# EAGLE design riffle-0.96-tab (EAGLE 7.3.0)
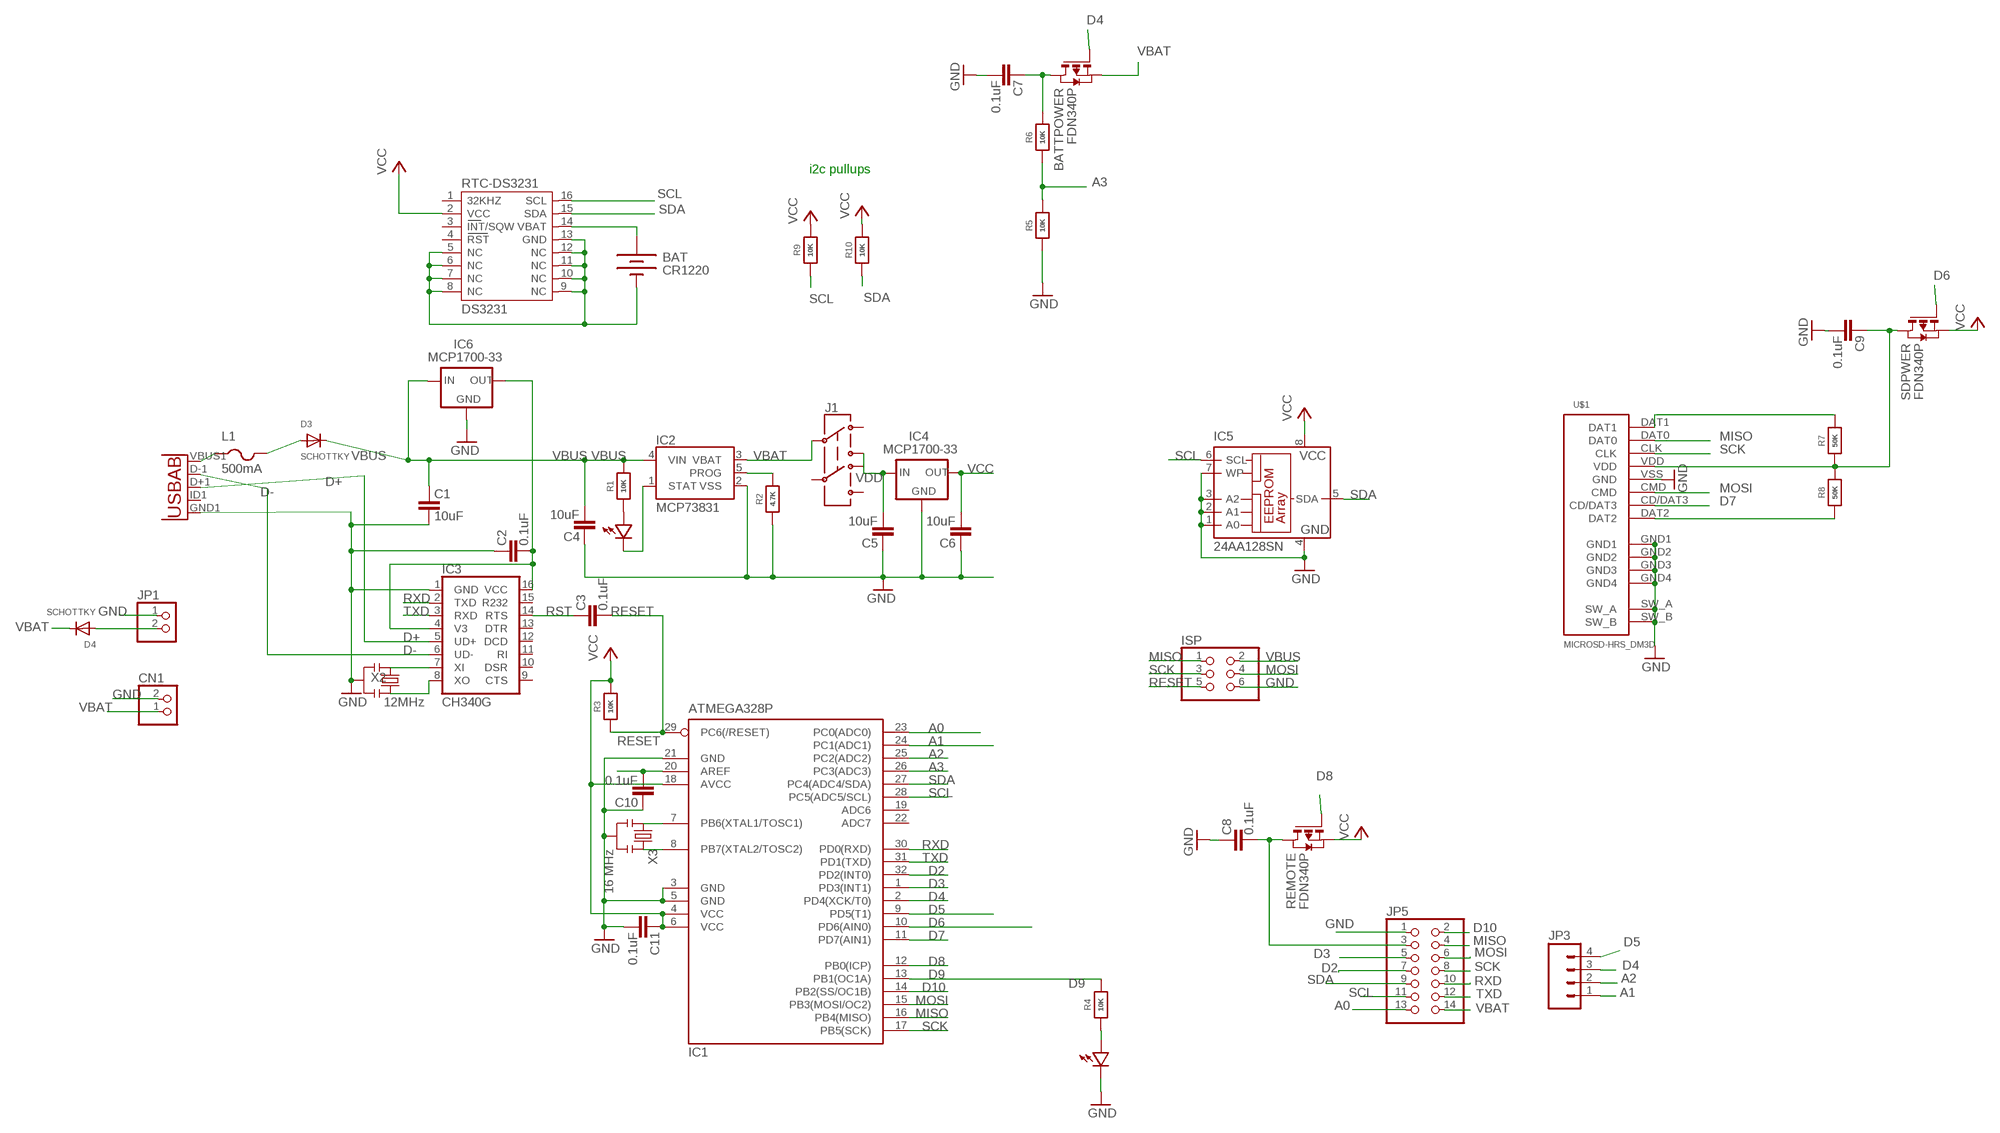
[diagram p0: schematic, sheet 1]

## Parts
BAT  CR1220  BATTERYBATTERY_12MM_SMT  [BATTCON_12MM_SMT]
BATTPOWER  FDN340P  PMOSSOT23  [SOT-23]
C1  10uF  CAP0603-CAP  [0603-CAP]
C2  0.1uF  CAP0603-CAP  [0603-CAP]
C3  0.1uF  CAP0603-CAP  [0603-CAP]
C4  10uF  CAP0603-CAP  [0603-CAP]
C5  10uF  CAP0603-CAP  [0603-CAP]
C6  10uF  CAP0603-CAP  [0603-CAP]
C7  0.1uF  CAP0603-CAP  [0603-CAP]
C8  0.1uF  CAP0603-CAP  [0603-CAP]
C9  0.1uF  CAP0603-CAP  [0603-CAP]
C10  0.1uF  CAP0603-CAP  [0603-CAP]
C11  0.1uF  CAP0603-CAP  [0603-CAP]
CN1  JST_2PIN-SMT-RA  [JST-PH-2-SMT-RA]
D1  LED0603  [0603-LED]
D2  LED0603  [0603-LED]
D3  SCHOTTKY  DIODE_SOD-123FL  [SOD-123FL]
D4  SCHOTTKY  DIODE_SOD-123FL  [SOD-123FL]
IC1  ATMEGA328P  MEGA8-AI  [TQFP32-08]
IC2  MCP73831  [SOT23-5]
IC3  CH340G  [SO16]
IC4  MCP1700-33  MCP1700SOT89  [SOT89]
IC5  24AA128SN  [SO-08]
IC6  MCP1700-33  MCP1700SOT89  [SOT89]
ISP  PINHD-2X3  [2X03]
J1  AYZ0202  [AYZ0202]
JP1  PINHD-1X2  [1X02]
JP3  M04SMD  [1X04-SMD]
JP5  PINHD-2X7  [2X07]
L1  500mA  PTCFUSE-1206  [R1206]
R1  10K  RESISTOR_0603_NOOUT  [0603-NO]
R2  4.7K  RESISTOR_0603_NOOUT  [0603-NO]
R3  10K  RESISTOR_0603_NOOUT  [0603-NO]
R4  10K  RESISTOR_0603_NOOUT  [0603-NO]
R5  10K  RESISTOR_0603_NOOUT  [0603-NO]
R6  10K  RESISTOR_0603_NOOUT  [0603-NO]
R7  50K  RESISTOR_0603_NOOUT  [0603-NO]
R8  50K  RESISTOR_0603_NOOUT  [0603-NO]
R9  10K  RESISTOR_0603_NOOUT  [0603-NO]
R10  10K  RESISTOR_0603_NOOUT  [0603-NO]
REMOTE  FDN340P  PMOSSOT23  [SOT-23]
RTC-DS3231  DS3231  [DS3231]
SDPWER  FDN340P  PMOSSOT23  [SOT-23]
U$1  MICROSD-HRS_DM3D  [DM3D]
U$4  USB-AB""  [USB-AB-MICRO-SMD_V02_BOSS]
X2  12MHz  RESONATORSMD  [RESONATOR-SMD]
X3  16 MHz  RESONATORSMD  [RESONATOR-SMD]

## Nets
A0: IC1.23(PC0(ADC0)) JP5.13
A1: IC1.24(PC1(ADC1)) JP3.1
A2: IC1.25(PC2(ADC2)) JP3.2
A3: IC1.26(PC3(ADC3)) R5.2 R6.1
AREF: C10.1 IC1.20(AREF)
D2: IC1.32(PD2(INT0)) JP5.7
D3: IC1.1(PD3(INT1)) JP5.5
D4: BATTPOWER.3(G) IC1.2(PD4(XCK/T0)) JP3.3
D5: IC1.9(PD5(T1)) JP3.4
D6: IC1.10(PD6(AIN0)) SDPWER.3(G)
D7: IC1.11(PD7(AIN1)) U$1.CD/DAT3
D8: IC1.12(PB0(ICP)) REMOTE.3(G)
D9: IC1.13(PB1(OC1A)) R4.2
D10: IC1.14(PB2(SS/OC1B)) JP5.2
D+: IC3.5(UD+) U$4.D+1(D+)
D-: IC3.6(UD-) U$4.D-1(D-)
GND: BAT.P$1(-) C1.1 C2.2 C4.2 C5.2 C6.2 C7.1 C8.2 C9.1 C10.2 C11.1 CN1.2 D2.MINUS IC1.3(GND) IC1.5(GND) IC1.21(GND) IC2.2(VSS) IC3.1(GND) IC4.1(GND) IC5.1(A0) IC5.2(A1) IC5.3(A2) IC5.4(GND) IC5.7(WP) IC6.1(GND) ISP.6 JP1.1 JP5.1 R2.1 R5.1 RTC-DS3231.5(NC) RTC-DS3231.6(NC) RTC-DS3231.7(NC) RTC-DS3231.8(NC) RTC-DS3231.9(NC) RTC-DS3231.10(NC) RTC-DS3231.11(NC) RTC-DS3231.12(NC) RTC-DS3231.13(GND) U$1.GND1 U$1.GND2 U$1.GND3 U$1.GND4 U$1.SW_A U$1.SW_B U$1.VSS(GND) U$4.GND1(GND) X2.2 X3.2
MISO: IC1.16(PB4(MISO)) ISP.1 JP5.4 U$1.DAT0
MOSI: IC1.15(PB3(MOSI/OC2)) ISP.4 JP5.6 U$1.CMD
N$1: D1.PLUS R1.1
N$2: IC1.7(PB6(XTAL1/TOSC1)) X3.1
N$3: IC1.8(PB7(XTAL2/TOSC2)) X3.3
N$4: C9.2 R7.1 R8.2 SDPWER.1(D) U$1.VDD
N$5: D1.MINUS IC2.1(STAT)
N$6: IC2.5(PROG) R2.2
N$7: C8.1 JP5.3 REMOTE.1(D)
N$8: C2.1 IC3.4(V3) IC3.16(VCC) IC6.3(OUT)
N$10: D3.A L1.2
N$11: IC3.7(XI) X2.1
N$13: IC3.8(XO) X2.3
N$14: D4.A JP1.2
N$15: BATTPOWER.1(D) C7.2 R6.2
N$16: R7.2 U$1.DAT1
N$17: D2.PLUS R4.1
N$18: R8.1 U$1.DAT2
N$19: L1.1 U$4.VBUS1(VBUS)
RESET: C3.1 IC1.29(PC6(/RESET)) ISP.5 R3.1
RST: C3.2 IC3.14(RTS)
RTC_BATT: BAT.P$2(+) RTC-DS3231.14(VBAT)
RXD: IC1.30(PD0(RXD)) IC3.2(TXD) JP5.10
SCK: IC1.17(PB5(SCK)) ISP.3 JP5.8 U$1.CLK
SCL: IC1.28(PC5(ADC5/SCL)) IC5.6(SCL) JP5.11 R9.1 RTC-DS3231.16(SCL)
SDA: IC1.27(PC4(ADC4/SDA)) IC5.5(SDA) JP5.9 R10.1 RTC-DS3231.15(SDA)
TXD: IC1.31(PD1(TXD)) IC3.3(RXD) JP5.12
VBAT [vcc]: BATTPOWER.2(S) CN1.1 D4.C IC2.3(VBAT) J1.2 JP5.14
VBUS [vcc]: C1.2 C4.1 D3.C IC2.4(VIN) IC6.2(IN) ISP.2 R1.2
VCC: C6.1 C11.2 IC1.4(VCC) IC1.6(VCC) IC1.18(AVCC) IC4.3(OUT) IC5.8(VCC) R3.2 R9.2 R10.2 REMOTE.2(S) RTC-DS3231.2(VCC) SDPWER.2(S)
VDD: C5.1 IC4.2(IN) J1.1
Unconnected: IC1.19(ADC6) IC1.22(ADC7) IC3.9(CTS) IC3.10(DSR) IC3.11(RI) IC3.12(DCD) IC3.13(DTR) IC3.15(R232) J1.3 J1.4 J1.5 J1.6 RTC-DS3231.1(32KHZ) RTC-DS3231.3(INT/SQW) RTC-DS3231.4(RST) U$4.ID1(USBID)

## Notes on the sheet
- i2c pullups

## Library data of the parts
BAT = SparkFunNew:BATTERY: Battery Holders Various common sizes : AA, AAA, 20mm coin cell and 12mm coin cell.
BATTPOWER REMOTE SDPWER = zetex:PMOSSOT23: MOS FET; OC_FARNELL: unknown; OC_NEWARK: unknown
C1-C11 = SparkFun:CAP: Capacitor Standard 0603 ceramic capacitor, and 0.1" leaded capacitor.
CN1 = adafruit:JST_2PIN: JST 2-Pin Connectors of various flavors SMT-RA (S2B-PH-SM4) 4UConnector #17311 SMT (B2B-PH-SM4) THM-RA (S2B-PH) THM (B2B-PH)
D1 D2 = LowPowerLab:LED
D3 D4 = adafruit:DIODE: Diode SMADIODE - SMA Surface Mount Package 20V 1A Schottky Diode Digikey: 641-1014-6-ND DO-1N4148 - Through Hole Small Current Diode SOD-123 20V 1 A (.5mV Vf) Schottky Diode - Digikey: MBRX120TPMSCT-ND SOD-323 10V 570mA (.38mV Vf, 3ns) Schottky Diode - Digikey: ZLLS410CT-ND SOD-523 30V 30mA Schottky Diode (RB751S-40TE61) - Digikey: RB751S-40TE61CT-ND SOT23-R/W - SOT23 Package (R = Solder Paste/Reflow Ovens, W = Hand-Soldering) BAT54Film 40V 300mA - Digikey: 497-7162-1-ND
IC1 = atmel:MEGA8: MICROCONTROLLER 8 Kbytes FLASH, 1 kbytes SRAM, 512 bytes EEPROM, USART, 6-channel 10 bit ADC, 2-channel 8 bit ADC Pin compatible with Atmega48, ATMega88, ATMega168 Source: avr.lbr; MPN: ATMEGA8-16AU; OC_FARNELL: 9171371; OC_NEWARK: 73M8863
IC2 = SparkFunNew:MCP73831: Microchip's MCP73831 Miniature single cell, fully integrated Li-Ion, Li-polymer charge management controller http://ww1.microchip.com/downloads/en/DeviceDoc/21984a.pdf
IC3 = SparkFunNew:CH340
IC4 IC6 = adafruit:MCP1700: VOLTAGE REGULATOR
IC5 = microchip:24*: Serial EEPROM I2C; MF: MICROCHIP; MPN: 24AA128-I/SN; OC_FARNELL: unknown; OC_NEWARK: 92C6842
ISP = pinhead:PINHD-2X3: PIN HEADER
J1 = SparkFunNew:AYZ0202: SPDT Slide Switch Simple SMD single-pull double-throw slide switch. Good for less than 350mA power switch, switching UARTs between devices, etc. Spark Fun Electronics SKU : COM-00597
JP1 = pinhead:PINHD-1X2: PIN HEADER
JP3 = SparkFun:M04: Header 4 Standard 4-pin 0.1" header. Use with straight break away headers (SKU : PRT-00116), right angle break away headers (PRT-00553), swiss pins (PRT-00743), machine pins (PRT-00117), and female headers (PRT-00115). Molex polarized connector foot print use with SKU : PRT-08231 with associated crimp pins and housings.
JP5 = pinhead:PINHD-2X7: PIN HEADER
L1 = adafruit:PTCFUSE: PTC fuses, resettable thermistors
R1-R10 = microbuilder:RESISTOR: Resistors For new designs, use the packages preceded by an '_' character since they are more reliable: The following footprints should be used on most boards: _0402 - Standard footprint for regular board layouts _0603 - Standard footprint for regular board layouts _0805 - Standard footprint for regular board layouts _1206 - Standard footprint for regular board layouts For extremely tight-pitch boards where space is at a premium, the following 'micro-pitch' footprints can be used (smaller pads, no silkscreen outline, etc.): _0402MP - Micro-pitch footprint for very dense/compact boards _0603MP - Micro-pitch footprint for very dense/compact boards _0805MP - Micro-pitch footprint for very dense/compact boards _1206MP - Micro-pitch footprint for very dense/compact boards
RTC-DS3231 = _lh-library:DS3231
U$1 = hrs_DM3D-SF:MICROSD-HRS_DM3D
U$4 = Testing:USB-AB: This is a USB AB connector that is compatible with USB OTG. i.e. this connector can serve as a host or device
X2 = SparkFunNew:RESONATOR: Resonator Small SMD resonator. This is the itty bitty 10/20MHz resonators with built in caps. CSTCE10M0G55 and CSTCE20M0V53. Footprint has been reviewed closely but hasn't been tested yet.
X3 = SparkFun:RESONATOR: Resonator Small SMD resonator. This is the itty bitty 10/20MHz resonators with built in caps. CSTCE10M0G55 and CSTCE20M0V53. Footprint has been reviewed closely but hasn't been tested yet.

## Board
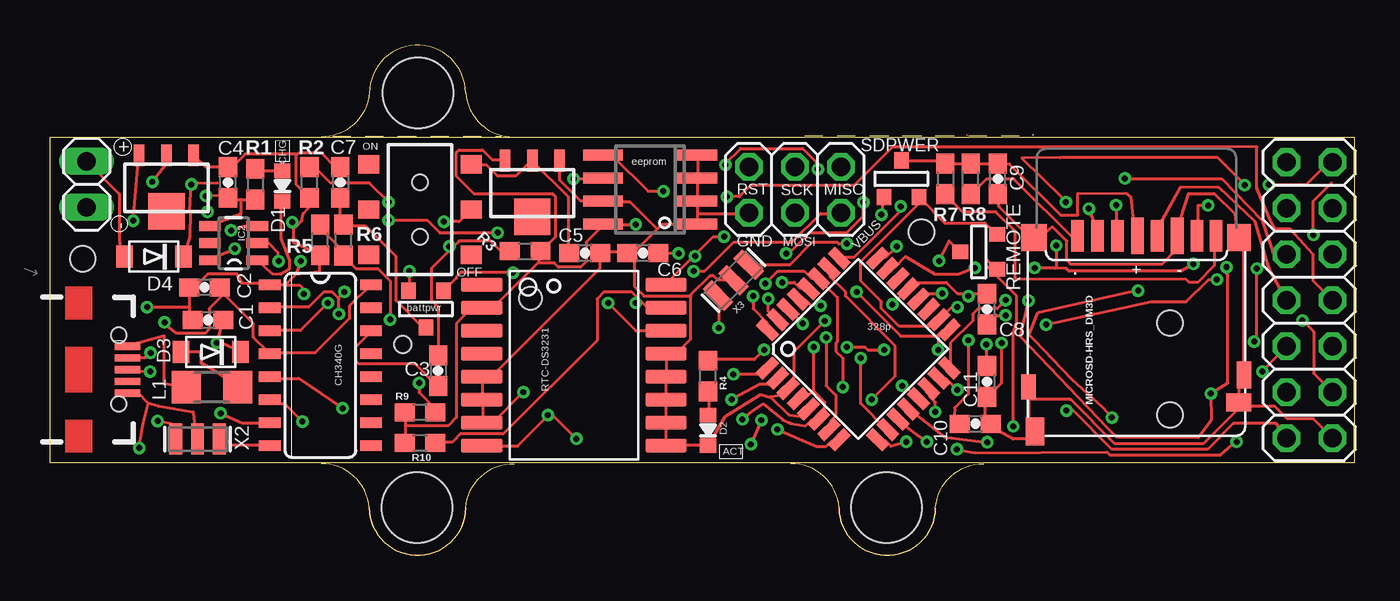
[diagram p1: board, top side]
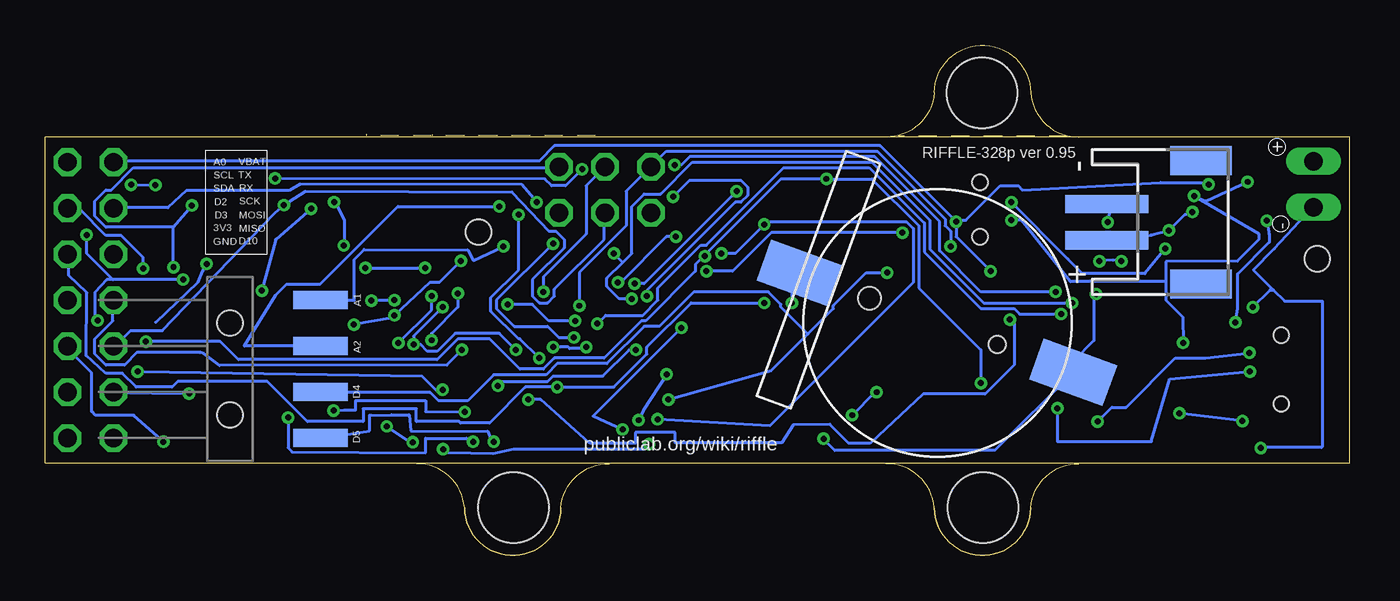
[diagram p2: board, bottom side, seen from below]

Size 72 x 28.19 mm. Coordinates in mm from the lower left corner, seen from the top.
Outline: 14.94,23.12 arc86 17.6,25.56 arc-179 22.92,25.56 arc86 25.59,23.12
Outline: 48.86,2.63 arc-179 43.54,2.63
Outline: 48.86,2.63 arc-86 51.52,5.07
Outline: 43.54,2.63 arc179 48.86,2.63
Outline: 43.54,2.63 arc86 40.87,5.07
Outline: 22.92,2.63 arc-179 17.6,2.63
Outline: 22.92,2.63 arc-86 25.59,5.07
Outline: 17.6,2.63 arc179 22.92,2.63
Outline: 17.6,2.63 arc86 14.94,5.07
Outline: 15.58,23.16 24.89,23.16 24.89,23.22
Outline: 41.63,23.18 50.61,23.18 50.61,23.26
Outline: 45.29,23.19 54.27,23.19 54.27,23.27
Outline: 0,5.11 0,23.11 72,23.11 72,5.11 0,5.11
Copper layers (1*16): Top 0.0356mm / dielectric 1.5011mm / Bottom 0.0356mm
Design rules "LaenPCBOrder": minimum track width 6mil, minimum drill 13mil, track to track 6mil, track to pad 6mil, pad to pad 6mil, via to via 6mil, smd to smd 6mil, copper to edge 15mil, drill to drill 6mil, minimum pad ring 7mil, minimum via ring 7mil, stop-mask expansion 3mil, vias tented up to drill 0mil, thermal gap 10mil
Holes 1.4 mm at 48.08,17.87 1.78,16.39
Holes 3.9 mm at 20.3,25.55 46.16,2.64 20.23,2.64

### Footprints (pad centres in the part's own frame; a part is rotated, then mirrored left to right if it is on the bottom)
BATTCON_12MM_SMT = smd 2.4 x 4.3: P$1 0,11.96 | smd 2.4 x 4.2: P$2 0,-4.1 | hole 0.95: 0,7.5 | hole 1.25: 0,0
SOT-23 = smd 0.787 x 0.889: 1 0.025,-1.016; 2 -0.94,1.016; 3 0.991,1.016
0603-CAP = smd 1.1 x 1: 1 -0.85,0; 2 0.85,0
JST-PH-2-SMT-RA = smd 1 x 4.6: 1 1,-3.7; 2 -1,-3.7 | smd 1.6 x 3.4: NC1 -3.4,1.5; NC2 3.4,1.5
0603-LED = smd 0.8 x 0.9: MINUS -0.85,0; PLUS 0.85,0
SOD-123FL = smd 0.91 x 1.22: A 1.637,0; C -1.637,0
TQFP32-08 = smd 1.27 x 0.559: 1 -4.293,2.8; 2 -4.293,2; 3 -4.293,1.2; 4 -4.293,0.4; 5 -4.293,-0.4; 6 -4.293,-1.2; 7 -4.293,-2; 8 -4.293,-2.8; 17 4.293,-2.8; 18 4.293,-2; 19 4.293,-1.2; 20 4.293,-0.4; 21 4.293,0.4; 22 4.293,1.2; 23 4.293,2; 24 4.293,2.8 | smd 0.559 x 1.27: 9 -2.8,-4.293; 10 -2,-4.293; 11 -1.2,-4.293; 12 -0.4,-4.293; 13 0.4,-4.293; 14 1.2,-4.293; 15 2,-4.293; 16 2.8,-4.293; 25 2.8,4.293; 26 2,4.293; 27 1.2,4.293; 28 0.4,4.293; 29 -0.4,4.293; 30 -1.2,4.293; 31 -2,4.293; 32 -2.8,4.293
SOT23-5 = smd 0.55 x 1.2: 1 -0.95,-1.3; 2 0,-1.3; 3 0.95,-1.3; 4 0.95,1.3; 5 -0.95,1.3; 6 0,1.3
SO16 = smd 0.6 x 1.2: 1 -4.445,-2.8; 2 -3.175,-2.8; 3 -1.905,-2.8; 4 -0.635,-2.8; 5 0.635,-2.8; 6 1.905,-2.8; 7 3.175,-2.8; 8 4.445,-2.8; 9 4.445,2.8; 10 3.175,2.8; 11 1.905,2.8; 12 0.635,2.8; 13 -0.635,2.8; 14 -1.905,2.8; 15 -3.175,2.8; 16 -4.445,2.8
SOT89 = smd 0.58 x 1.2: 1 -1.5,-1.8; 2 0,-1.8; 3 1.5,-1.8 | smd 2 x 2: 4 0,1.3
SO-08 = smd 0.6 x 2.2: 1 -1.905,-2.6; 2 -0.635,-2.6; 3 0.635,-2.6; 4 1.905,-2.6; 5 1.905,2.6; 6 0.635,2.6; 7 -0.635,2.6; 8 -1.905,2.6
2X03 = drill 1.016 octagon: 1 -2.54,-1.27; 2 -2.54,1.27; 3 0,-1.27; 4 0,1.27; 5 2.54,-1.27; 6 2.54,1.27
AYZ0202 = smd 1 x 1.15: 1 -2.5,2.825; 2 0,2.825; 3 2.5,2.825; 4 -2.5,-2.825; 5 0,-2.825; 6 2.5,-2.825 | hole 0.85: 1.5,0; -1.5,0
1X02 = drill 1.016 long: 1 -1.27,0; 2 1.27,0
1X04-SMD = smd 1 x 3: 1 -3.81,5; 2 -1.27,5; 3 1.27,5; 4 3.81,5 | hole 1.4: -2.54,0; 2.54,0
2X07 = drill 1.016 octagon: 1 -7.62,-1.27; 2 -7.62,1.27; 3 -5.08,-1.27; 4 -5.08,1.27; 5 -2.54,-1.27; 6 -2.54,1.27; 7 0,-1.27; 8 0,1.27; 9 2.54,-1.27; 10 2.54,1.27; 11 5.08,-1.27; 12 5.08,1.27; 13 7.62,-1.27; 14 7.62,1.27
R1206 = smd 1.6 x 1.803: 1 -1.422,0; 2 1.422,0
0603-NO = smd 1.1 x 1: 1 -0.85,0; 2 0.85,0
DS3231 = smd 0.762 x 2.286: 1 -4.445,-5.08; 2 -3.175,-5.08; 3 -1.905,-5.08; 4 -0.635,-5.08; 5 0.635,-5.08; 6 1.905,-5.08; 7 3.175,-5.08; 8 4.445,-5.08; 9 4.445,5.08; 10 3.175,5.08; 11 1.905,5.08; 12 0.635,5.08; 13 -0.635,5.08; 14 -1.905,5.08; 15 -3.175,5.08; 16 -4.445,5.08
DM3D = smd 0.7 x 1.75: CD/DAT3 8.15,0.45; CLK 4.85,0.45; CMD 7.05,0.45; DAT0 2.65,0.45; DAT1 1.6,0.45; DAT2 9.25,0.45 | smd 0.8 x 1.5: GND1 0.05,8.15 | smd 0.8 x 1.4: GND2 11.95,8.8 | smd 1.4 x 1.5: GND3 11.65,0.55 | smd 1.3 x 1.5: GND4 0.35,0.55 | smd 1 x 1.55: SW_A 11.6,11.25 | smd 1.4 x 1: SW_B 0.35,9.65 | smd 0.7 x 2.032: VDD 5.95,0.45; VSS 3.75,0.45
USB-AB-MICRO-SMD_V02_BOSS = smd 1.4 x 0.4: D+1 2.7,0; D-1 2.7,0.65; GND1 2.7,-1.3; ID1 2.7,-0.65; VBUS1 2.7,1.3 | hole 0.85: 2.2,1.9; 2.2,-1.9
RESONATOR-SMD = smd 0.7 x 1.7: 1 -1.2,0; 2 0,0; 3 1.2,0

### Placement (x,y rotation side)
BAT  26.5,14.21 250 bottom
BATTPOWER  20.7,13.61 0 top
C1  8.7,13.01 0 top
C2  8.5,14.81 180 top
C3  21.4,10.21 270 top
C4  9.8,20.61 90 top
C5  29.5,16.71 0 top
C6  32.7,16.71 180 top
C7  16,20.61 270 top
C8  51.7,13.61 90 top
C9  52.3,20.81 90 top
C10  51.06,7.28 0 top
C11  51.7,9.61 90 top
CN1  9.7,18.41 270 bottom
D1  12.8,20.41 90 top
D2  36.3,6.91 90 top
D3  8.85,11.23 180 top
D4  5.71,16.51 180 top
IC1  44.6,11.41 45 top
IC2  10.11,17.26 90 top
IC3  14.9,10.51 270 top
IC4  26.6,20.01 180 top
IC5  33.1,20.21 90 top
IC6  6.4,20.31 180 top
ISP  41.1,20.21 180 top
J1  20.4,19.11 270 top
JP1  2,20.51 90 top
JP3  61.8,10.31 270 bottom
JP5  69.5,14.11 90 top
L1  8.9,9.29 0 top
R1  11.3,20.51 270 top
R2  14.3,20.61 90 top
R3  26.2,16.81 0 top
R4  36.3,9.91 90 top
R5  14.89,17.43 90 top
R6  16.18,17.42 90 top
R7  49.4,20.81 270 top
R8  50.8,20.81 90 top
R9  20.4,7.91 180 top
R10  20.4,6.21 180 top
REMOTE  51.25,16.8 270 top
RTC-DS3231  28.9,10.51 270 top
SDPWER  47,20.81 180 top
U$1  65.95,18.11 180 top
U$4  1.56,10.26 0 top
X2  8.12,6.43 0 top
X3  37.7,15.21 225 top

### Tracks (layer width: path | path; a pad name or v marks a point on that pad's centre or on a via)
A0  (via drill 0.33)
  Top 0.152: v51.03,15.89 50.11,15.52 48.83,15.52 47.19,16.5 46.63,15.93 46.25,15.93 IC1.23 | 55.45,15.87 56.08,15.85 56.24,15.7 62.43,15.73 62.43,15.7 v63.09,16.11 | 55.45,15.87 v54.33,15.89 | JP5.13 70.57,21.73 69.29,20.45 67.6,20.46 v67.26,20.48 | v65.93,20.46 65.94,20.48 64.83,21.58 64.83,21.59 64.45,21.97 55.73,21.97 53.62,21.96 55.83,19.79 v56.06,19.52 | v55.52,17.12 55.51,15.93 55.45,15.87
  Bottom 0.152: v51.03,15.89 52.9,15.87 v54.33,15.89 | 65.91,12.88 63.55,15.12 63.3,15.7 v63.09,16.11 | v67.26,20.48 66.06,20.46 v65.93,20.46 | v56.06,19.52 55.99,19.52 55.49,18.51 55.49,17.08 v55.52,17.12
A1  (via drill 0.33)
  Top 0.152: v46.71,17.07 46.1,16.46 45.72,16.46 IC1.24
  Bottom 0.152: v46.71,17.07 48.37,16.3 48.69,16.88 54.39,16.91 54.94,16.36 54.94,14.1 56.33,14.1 56.77,14.18 JP3.1
A2  (via drill 0.33)
  Top 0.152: v46.94,19.28 46.94,19.05 44.35,16.46 43.59,16.46 IC1.25
  Bottom 0.152: v46.94,19.28 52.54,19.28 56.83,14.99 58.67,14.99 59.28,14.38 61.01,11.56 57.38,11.59 56.84,11.59 JP3.2
A3  (via drill 0.33)
  Top 0.152: R5.2 14.71,18.21 14.83,18.14 16.2,16.77 R6.1 16.15,16.54 16.84,15.85 18.06,15.85 18.75,15.17 v18.75,13.03 | v45.34,8.61 46.63,9.91 46.63,11.59 43.89,14.33 43.89,14.56 43.05,15.4 43.05,15.85 IC1.26
  Bottom 0.152: v45.34,8.61 44.65,8.61 41.94,6.2 39.42,6.2 39.42,6.78 37.24,6.78 37.24,6.23 31.33,6.23 30.7,7.22 28.69,7.24 27.65,6.2 26.47,6.2 23.55,8.92 20.12,8.92 18.52,10.52 18.52,12.8 v18.75,13.03
AREF  (via drill 0.33)
  Top 0.152: v50.67,11.89 50.67,8.92 49.91,8.16 49.86,7.27 C10.1 | v49.23,14.48 48.23,14.48 47.93,14.18 IC1.20
  Bottom 0.152: v50.67,11.89 50.67,12.27 49.23,13.72 v49.23,14.48
D2  (via drill 0.33)
  Top 0.152: v38.79,14.33 38.79,13.64 39.55,12.88 39.55,12.5 IC1.32 | v37.34,19.82 38.02,19.82 38.63,20.42 44.35,20.42 46.48,22.56 63.4,22.56 63.36,22.57 66.6,22.58 66.6,20.3 67.36,18.47 67.61,18.04 68.45,18.04 69.72,16.61 69.72,15.17 70.71,14.18 JP5.7
  Bottom 0.152: v38.79,14.33 38.79,14.63 33.91,19.51 33.6,19.51 33.22,19.89 33.22,20.35 33.6,20.73 36.42,20.73 v37.34,19.82
D3  (via drill 0.33)
  Top 0.152: IC1.1 39.24,10.01 v37.7,10.01 | v39.24,7.47 38.76,6.38 v38.66,6.14 | v50.04,5.87 51.05,5.67 58.32,5.72 58.47,5.57 64.59,5.57 65.28,6.12 v65.48,6.28
  Bottom 0.152: v37.7,10.01 38.99,8.01 v39.24,7.47 | v38.66,6.14 38.99,5.86 42.67,5.86 46.16,5.87 47.3,5.62 49.73,5.67 49.94,5.87 v50.04,5.87 | v65.48,6.28 65.58,6.38 67.11,7.75 69.24,7.75 69.44,7.95 69.44,10.09 70.77,11.41 JP5.5
D4  (via drill 0.33)
  Top 0.152: v25.53,15.62 22.63,15.62 22.4,15.4 22.4,15.32 21.72,14.63 BATTPOWER.3 | v37.6,8.61 39.17,9.45 39.78,9.45 40.08,9.76 IC1.2
  Bottom 0.152: v25.53,15.62 26.67,15.62 28.5,13.8 28.5,13.64 29.91,12.23 | 29.91,12.23 31.93,10.21 v37.6,8.61 | 29.91,12.23 31.39,13.72 31.39,13.87 32.08,14.56 36.2,14.56 38.1,12.65 38.94,12.65 41,10.59 43.74,10.59 44.35,9.99 47.24,9.99 48.69,8.54 50.29,8.54 50.75,8.99 56.77,8.99 JP3.3
D5  (via drill 0.33)
  Top 0.152: v47.24,6.28 46.41,6.02 46.1,6.33 45.72,6.33 IC1.9
  Bottom 0.152: v47.24,6.28 47.4,6.43 47.57,6.86 51.82,6.89 51.92,7.78 52.88,7.78 54.03,7.75 54.1,7.75 54.1,6.89 55.98,6.58 56.77,6.56 JP3.4
D6  (via drill 0.33)
  Top 0.152: v45.87,18.82 45.95,18.9 45.95,19.74 SDPWER.3 | v44.73,10.9 44.73,8.39 46.18,6.94 IC1.10
  Bottom 0.152: v45.87,18.82 45.87,15.78 47.4,14.25 47.4,13.49 45.87,11.97 45.8,11.97 v44.73,10.9
D7  (via drill 0.33)
  Top 0.152: v48.39,6.28 46.79,7.47 IC1.11 | v58.6,7.62 58.09,8.18 56.36,9.76 54.3,11.92 54,12.2 54.48,13.39 60.01,14.65 v60.05,14.63 | v57.33,19.15 57.99,17.61 57.76,17.38 U$1.CD/DAT3
  Bottom 0.152: v48.39,6.28 48.74,6.48 51,6.48 51,5.67 58.37,5.72 58.6,5.95 v58.6,7.62 | v60.05,14.63 59.28,17.45 v57.33,19.15
D8  (via drill 0.33)
  Top 0.152: v53.15,7.13 53.15,8.99 53.14,12.28 53.33,12.78 53.34,12.83 53.34,14.33 51.66,16.01 51.66,16.39 REMOTE.3 | v51.71,6.25 49.73,6.51 49.38,6.53 47.4,8.08 IC1.12
  Bottom 0.152: v53.15,7.13 51.89,6.28 v51.71,6.25
D9  (via drill 0.33)
  Top 0.152: v39.4,11.36 38.86,10.82 36.35,10.82 R4.2 | v47.02,9.38 47.17,9.38 47.85,8.69 IC1.13
  Bottom 0.152: v39.4,11.36 39.78,11.36 41.22,9.91 43.97,9.91 44.27,9.6 46.79,9.6 v47.02,9.38
D10  (via drill 0.33)
  Top 0.152: v48.84,7.93 48.84,8.46 48.54,8.77 48.54,9.15 IC1.14 | v56.08,8 56.46,8 58.6,5.87 63.88,5.87 65.3,7.29 67.67,7.29 68.2,6.48 JP5.2
  Bottom 0.152: v48.84,7.93 51,7.95 51,8.56 54.86,8.56 54.86,8.03 55.5,8.03 v56.08,8
D+  (via drill 0.33)
  Top 0.152: IC3.5 12.19,9.78 13.7,9.78 v16.13,8.13 | v5.5,10.16 4.81,10.14 U$4.D+1
  Bottom 0.152: v16.13,8.13 16.13,6.29 10.94,6.29 9.92,9.74 v5.5,10.16
D-  (via drill 0.33)
  Top 0.152: IC3.6 12.31,8.4 12.9,8.4 v13.91,7.39 | v5.52,11.19 5.25,10.91 U$4.D-1
  Bottom 0.152: v13.91,7.39 13.12,8.18 12.33,8.18 9.61,10.9 7.95,10.9 v5.52,11.19
GND  (via drill 0.33)
  Top 0.152: 50.67,14.48 50.06,14.48 49.45,15.09 47.7,15.09 47.4,14.79 IC1.21 47.32,14.71 v46.48,13.87 | 50.67,14.48 51.66,14.48 C8.2 | 54.03,8.61 54.03,6.86 54.25,6.63 U$1.SW_A 54.12,6.43 53.11,6.43 53.09,6.45 51.66,7.22 C10.2 51.59,7.37 51.59,8.61 51.66,8.69 C11.1 51.74,8.77 52.5,9.53 v52.5,11.74 | 54.03,8.61 54.03,8.99 U$1.GND2 54.03,8.61 | v50.67,14.33 50.67,14.48 | U$1.SW_B 65.61,8.23 65.61,9.38 65.84,9.6 U$1.GND1 65.84,9.68 65.84,17 65.61,17.22 U$1.GND4 65.53,17.3 65.38,18.9 64.24,19.99 62.84,19.99 62.18,17.91 62.18,17.38 U$1.VSS 62.1,17.3 62.1,16.84 61.34,16.08 56.31,16.08 56.11,16.34 56.11,17.38 55.31,18.16 54.25,17.22 U$1.GND3 54.18,17.3 54.18,17.45 52.35,19.28 52.35,19.89 C9.1 | U$1.SW_B 65.68,8.23 67.59,8.23 68.28,7.55 69.72,7.55 70.71,6.56 JP5.1 | 54.03,8.61 56.31,8.61 58.75,6.18 63.63,6.18 65.53,8.08 U$1.SW_B | 7.7,13.72 7.7,13.19 7.85,13.03 C1.1 | 7.7,13.72 7.7,14.79 C2.2 7.77,14.79 7.92,14.79 8.69,15.55 10.29,15.55 10.58,15.03 12.04,15.01 IC3.1 | v5.33,13.72 7.7,13.72 | IC6.1 7.92,22.1 8.53,21.49 9.75,21.49 C4.2 9.83,21.49 10.06,21.49 10.74,22.18 13.56,22.18 13.6,22.14 | 12.12,14.94 IC3.1 | 14.8,16.69 13.41,17.3 13.41,18.02 13.6,18.21 | 14.8,16.69 14.72,16.67 14.63,16.61 R5.1 | 13.6,18.21 13.88,18.49 13.95,18.9 14.25,19.21 14.25,19.74 R2.1 14.25,19.82 13.56,20.5 13.56,22.1 13.6,22.14 | 13.6,22.14 13.72,22.25 14.94,22.25 15.7,21.49 15.93,21.49 C7.1 | 12.95,14.94 12.19,14.94 IC3.1 | 13.53,15.52 14.83,15.66 14.82,16.61 14.8,16.69 | 13.53,15.52 12.95,14.94 | 35.36,14.33 35.36,11.97 34.59,11.2 33.98,11.2 RTC-DS3231.13 33.98,11.13 33.98,9.91 RTC-DS3231.12 33.98,9.83 RTC-DS3231.11 33.98,8.54 33.98,7.39 RTC-DS3231.10 33.98,7.32 33.98,6.18 RTC-DS3231.9 33.98,6.1 36.27,6.1 D2.MINUS 36.35,6.1 37.26,7.67 39.22,8.89 39.76,8.73
  Top 0.152: 35.36,14.33 35.36,14.4 36.42,15.47 36.58,15.47 36.8,15.24 37.64,15.24 X3.2 | 39.76,8.73 39.78,8.77 40.39,8.84 40.69,9.15 IC1.3 40.77,9.22 41.07,9.53 41.07,11.28 v42.75,12.96 | 39.76,8.73 40.77,7.78 41.4,7.67 41.83,8.08 IC1.5 | IC4.1 28.12,21.8 28.12,20.73 29.26,19.59 30.48,19.59 IC5.7 30.56,19.51 32,19.51 33.49,18.02 | IC5.4 35.74,22.1 35.74,20.88 IC5.3 35.74,20.81 35.74,19.59 IC5.2 35.74,19.51 35.74,18.9 | C6.2 31.77,16.77 30.4,16.77 C5.2 30.33,16.69 30.33,15.85 24.31,9.83 23.93,9.83 RTC-DS3231.5 23.85,9.83 23.85,8.61 RTC-DS3231.6 23.85,8.54 23.85,7.39 RTC-DS3231.7 24.43,7.33 v26.11,9.02 | 33.49,18.02 33.76,18.29 35.66,18.29 IC5.1 35.74,18.37 35.74,18.9 | 33.49,18.02 32.16,16.69 31.93,16.69 C6.2 | 35.74,18.9 38.56,18.9 ISP.6 | 35.36,14.33 32.77,14.33 32.23,14.86 32.23,16.69 C6.2 | X2.2 8.04,6.43 7.92,7.65 7.89,7.92 5.97,8.22 5.38,8.39 | 5.38,8.39 4.88,8.96 4.68,8.94 U$4.GND1 | v4.9,5.93 5.11,7.18 5.38,8.39 | RTC-DS3231.8 23.84,6.05 25.81,6.05 27.46,7.7 v27.46,7.75 27.72,7.75 v29.03,6.44 | 12.95,14.94 13.75,14.94 13.99,14.7 v13.99,14.44 | v13.35,18.41 13.6,18.27 13.6,18.21 | IC2.2 12.05,17.25 12.56,16.74 v12.6,16.26 | v13.8,16.26 13.53,15.53 13.53,15.52
  Bottom 0.152: v50.67,14.33 50.67,13.57 v52.5,11.74 | JP1.1 2.06,19.21 4.15,16.94 5.31,15.78 4.2,14.67 | v46.48,13.87 45.11,13.87 44.2,12.96 v42.75,12.96 | 4.2,14.67 3.58,14.05 1.49,14.05 1.5,14.04 1.5,6.01 1.55,5.96 4.94,5.96 4.92,5.93 v4.9,5.93 | v5.33,13.72 4.38,14.67 4.2,14.67 | v27.46,7.75 26.19,9.02 v26.11,9.02 | v13.99,14.44 14.11,14.33 14.11,11.86 15.26,10.71 BAT.P$1 19.57,5.81 28.42,5.81 | 28.43,5.81 28.42,5.81 | 28.42,5.81 29.03,6.42 v29.03,6.44 | CN1.2 13.22,19.23 v13.35,18.41 | v12.6,16.26 13.06,16.31 v13.8,16.26
MISO  (via drill 0.33)
  Top 0.152: v52.73,14.1 52.27,13.64 51.21,13.64 50.9,13.34 50.9,12.96 49.68,11.74 49.68,10.37 IC1.16 | v54,14.07 53.54,12.09 58.37,7.01 58.67,6.71 58.93,6.53 63.37,6.51 64.08,7.47 v64.06,8.94 65,9.53 65,15.47 64.92,15.55 v64.92,15.93 | v63.91,19.33 63.35,19.33 63.32,17.99 63.32,17.38 U$1.DAT0
  Bottom 0.152: v52.73,14.1 53.57,14.1 v54,14.07 | v64.06,8.94 68.2,8.99 JP5.4 | v64.92,15.93 64.92,18.14 | 64.92,18.14 v63.91,19.33 | 64.92,18.14 68.66,18.14 69.27,18.75 69.27,19.59 68.66,20.2 68.35,20.2 67.13,21.42 43.66,21.42 ISP.1
MOSI  (via drill 0.33)
  Top 0.152: v50.06,9.15 49.45,9.76 49.07,9.76 IC1.15 | v66.9,10.16 68.2,11.51 JP5.6 | v58.83,19.36 58.83,17.38 U$1.CMD
  Bottom 0.152: v50.06,9.15 50.44,9.15 51.21,9.91 v66.9,10.16 | JP5.6 68.2,11.51 67.28,12.42 65.53,12.42 59.36,18.9 v58.83,19.36 57.63,20.12 46.24,20.08 44.2,17.91 43.81,17.91 43.36,17.45 43.36,17 45.11,15.24 45.11,14.33 44.73,13.95 44.27,13.95 43.89,14.33 43.89,14.71 41.15,17.45 41.15,18.9 ISP.4
N$1
  Top 0.152: D1.PLUS 12.72,21.26 11.43,21.26 11.35,21.34 R1.1
N$2  (via drill 0.33)
  Top 0.152: v42.82,12.04 42.82,9.38 43.36,8.84 43.36,7.7 43.05,7.39 43.05,7.01 IC1.7 | v43.97,17.22 43.51,17.22 43.43,17.3 42.06,17.3 40.84,16.08 38.56,16.08 X3.1
  Bottom 0.152: v42.82,12.04 43.66,12.04 44.27,12.65 46.1,12.65 47.09,13.64 47.09,14.1 v43.97,17.22
N$3  (via drill 0.33)
  Top 0.152: v40.13,6.96 42.29,6.02 42.82,6.02 43.13,6.33 43.51,6.33 IC1.8 | v36.88,12.58 36.88,14.33 X3.3
  Bottom 0.152: v40.13,6.96 41.76,7.7 v36.88,12.58
N$4
  Top 0.152: SDPWER.1 47.02,21.8 49.3,21.8 49.38,21.72 R7.1 49.45,21.64 50.75,21.64 R8.2 50.83,21.64 52.27,21.64 C9.2 52.35,21.64 52.93,21.63 55.77,18.81 56.72,18.81 56.72,20.01 59.38,19.99 59.64,19.79 59.89,17.38 U$1.VDD
N$5
  Top 0.152: D1.MINUS 12.72,19.51 12.75,19.09 12.74,18.57 12.74,17.52 13.21,16.32 13.21,15.97 13.18,15.83 12.68,15.56 12.22,15.59 IC2.1
N$6  (via drill 0.33)
  Top 0.152: v18.67,19.51 17.6,20.58 15.47,20.58 14.63,21.42 14.33,21.42 R2.2 | v10.17,16.94 9.78,16.75 IC2.5
  Bottom 0.152: v18.67,19.51 15.54,16.39 14.76,15.57 11.3,15.57 v10.17,16.94
N$7  (via drill 0.33)
  Top 0.152: v49.06,16.27 49.61,17.38 REMOTE.1 | v52.73,13.26 52.2,13.26 51.74,12.8 C8.1 | 70.71,20.58 69.72,19.59 v69.72,17.71 | v64.39,15.24 63.93,15.24 62.71,14.02 60.8,14.02 v54.97,12.75 | v69.11,12.98 69.3,12.8 69.74,12.37 69.74,10.06 JP5.3
  Bottom 0.152: v49.06,16.27 50.23,15.1 50.76,15.1 v52.73,13.26 52.88,13.11 v54.97,12.75 | v69.72,17.71 69.72,16.69 68.28,15.24 | v64.39,15.24 68.28,15.24 | 68.28,15.24 68.61,15.24 69.27,14.53 69.28,12.87 v69.11,12.98
N$8  (via drill 0.33)
  Top 0.152: v4.57,18.49 4.88,22.1 IC6.3 | v6.3,12.88 6.53,12.63 6.96,12.27 8.53,12.27 8.76,12.5 8.76,13.64 9.53,14.4 C2.1 9.37,14.79 9.37,14.63 11.2,12.8 11.2,12.04 12.04,11.2 IC3.4 12.12,11.2 14.63,11.2 16.54,13.11 16.54,13.8 17.68,14.94 IC3.16
  Bottom 0.152: v6.3,12.88 6.17,13.64 6.17,15.55 4.42,17.3 4.45,17.73 v4.57,18.49
N$10
  Top 0.152: D3.A 7.43,11.23 8.31,11.23 8.32,10.63 8.8,10.35 9.77,9.74 L1.2
N$11  (via drill 0.33)
  Top 0.152: v9.4,7.85 10.59,7.32 12.04,7.32 IC3.7 | v5.92,7.42 6.66,7.27 7.16,6.56 X2.1
  Bottom 0.152: v5.92,7.42 v9.4,7.85
N$13
  Top 0.152: IC3.8 12.04,6.1 9.98,6.1 9.6,6.48 X2.3
N$14
  Top 0.152: JP1.2 2.06,21.72 3.81,19.97 3.81,17.41 3.89,16.78 4.07,16.6 D4.A
N$15
  Top 0.152: BATTPOWER.1 20.65,12.65 20.5,12.65 19.05,14.1 19.05,16.54 17.37,18.21 16.15,18.21 R6.2 16.08,18.29 16,18.37 16,19.74 C7.2
N$16
  Top 0.152: R7.2 49.45,19.89 50.37,18.98 52.2,18.98 53.26,17.91 53.26,15.27 62.71,15.24 62.87,15.09 63.32,15.09 64.24,16.01 64.24,17.3 U$1.DAT1
N$17
  Top 0.152: D2.PLUS 36.35,7.78 36.35,8.99 R4.1
N$18
  Top 0.152: R8.1 50.83,19.97 51.66,20.81 53.19,20.81 56.62,17.38 U$1.DAT2
N$19
  Top 0.152: L1.1 6.81,9.4 6.33,9.46 6.29,9.46 6.29,11.23 6.28,12.12 U$4.VBUS1
RESET  (via drill 0.33)
  Top 0.152: 22.14,16.96 22.55,17.38 24.31,17.38 24.84,16.84 25.3,16.84 R3.1 | 22.14,16.96 21.03,15.85 21.03,14.1 21.41,13.72 21.41,11.13 C3.1 | v42.52,13.8 41.99,13.8 41.68,14.1 41.3,14.1 IC1.29 | v22.02,17.07 22.14,16.96
  Bottom 0.152: v42.52,13.8 42.52,15.62 39.93,18.21 39.93,20.12 38.63,21.42 ISP.5 38.56,21.49 37.72,22.33 26.06,22.33 22.33,18.6 22.33,18.21 22.02,17.91 v22.02,17.07
RST
  Top 0.152: C3.2 21.34,9.38 20.12,10.59 16.99,10.59 16.84,10.75 16.84,11.51 17.68,12.35 IC3.14
RTC_BATT  (via drill 0.33)
  Top 0.152: v30.79,13.95 32.31,12.42 33.91,12.42 RTC-DS3231.14
  Bottom 0.152: v30.79,13.95 30.79,15.17 30.4,15.55 BAT.P$2
RXD  (via drill 0.33)
  Top 0.152: 15.89,14.21 15.93,14.18 v15.93,13.34 | 15.89,14.21 15.54,14.56 15.09,14.56 14.25,13.72 12.12,13.72 IC3.2 | v41.53,12.8 40.77,13.57 IC1.30 | v59.31,20.83 64.66,20.82 66.89,18.51 66.9,18.49 66.9,18.47 67.51,16.69 68.2,16.69 JP5.10 | v42.37,21.34 42.37,21.64 41.53,22.48 38.1,22.48 37.26,21.64 v37.26,21.57 | 15.89,14.21 v16.23,14.56
  Bottom 0.152: v15.93,13.34 18.21,13.34 18.52,13.64 20.34,13.64 23.47,16.77 23.47,18.37 26.52,21.42 31.24,21.42 35.51,17.15 35.81,17.15 38.18,14.79 38.18,14.1 39.01,13.26 41.07,13.26 v41.53,12.8 | v59.31,20.83 44.42,20.81 44.04,20.42 43.28,20.42 v42.37,21.34 | v37.26,21.57 36.88,21.57 36.42,22.02 26.21,22.02 22.63,18.44 22.63,16.84 20.34,14.56 v16.23,14.56
SCK  (via drill 0.33)
  Top 0.152: U$1.CLK 61.11,17.38 61.11,18.06 62.38,20.35 64.5,20.34 64.52,20.31 66.03,18.89 66.5,18.44 67.21,16.11 67.36,15.67 68.2,14.18 JP5.8 | 48.96,12.16 48.92,12.12 46.94,12.12 v44.5,14.56 | 48.96,12.16 49.23,12.42 49.61,12.42 IC1.17 | v49,11.36 49,12.12 48.96,12.16
  Bottom 0.152: v44.5,14.56 44.5,15.4 42.14,17.76 42.14,20.42 41.15,21.42 ISP.3 | v49,11.36 49.84,10.52 62.38,10.49 63.25,11.15 63.45,11.2 66.95,11.2 67.61,10.52 68.66,10.52 69.27,11.13 69.27,11.97 68.28,12.96 68.28,14.1 JP5.8
SCL  (via drill 0.33)
  Top 0.152: v40.39,15.09 41.07,15.09 41.38,14.79 41.83,14.79 IC1.28 | v37.19,17.61 36.58,17.61 35.55,16.58 | 35.55,16.58 33.98,15.01 RTC-DS3231.16 | v20.34,9.53 20.34,8.99 21.18,8.16 21.18,7.93 R9.1 | v28.88,20.81 30.48,20.81 IC5.6 | v66.6,15.85 66.6,11.97 v66.45,11.81 | v35.59,16.54 35.55,16.58
  Bottom 0.152: v40.39,15.09 40.23,15.09 37.72,17.61 v37.19,17.61 | v20.34,9.53 20.34,11.36 23.77,14.79 23.77,18.21 26.36,20.81 v28.88,20.81 31.39,20.81 35.62,16.58 | v66.6,15.85 66.6,16.46 67.82,17.68 68.66,17.68 70.1,19.13 70.71,19.13 JP5.11 | v66.45,11.81 62.33,11.81 61.34,10.82 50.37,10.82 49.23,11.97 47.47,11.97 45.8,10.29 44.5,10.29 43.89,10.9 41.15,10.9 39.09,12.96 38.86,12.96 36.12,15.7 36.12,16.08 35.62,16.58 | v35.59,16.54 35.62,16.58
SDA  (via drill 0.33)
  Top 0.152: 32.5,14.14 32.92,13.72 33.91,13.72 RTC-DS3231.15 | 32.5,14.14 32.08,14.56 30.56,14.56 30.18,14.18 30.18,11.89 24.99,6.71 22.63,6.71 22.17,6.25 21.26,6.25 R10.1 | v39.47,15.01 40.16,15.7 41.6,15.7 41.99,15.32 42.37,15.32 IC1.27 42.44,15.24 43.43,14.25 43.43,11.81 43.36,11.74 43.36,11.28 43.74,10.9 v43.74,9.3 | v33.83,20.12 32.99,20.12 31.01,22.1 30.56,22.1 IC5.5 | v32.31,13.95 32.5,14.14
  Bottom 0.152: v39.47,15.01 38.94,15.01 v33.83,20.12 | JP5.9 70.71,16.61 70.71,15.47 69.71,14.52 69.75,11.04 68.66,10.06 67.74,10.06 66.98,9.3 65,9.3 64.69,9.6 59.74,9.6 57.53,7.39 54.46,7.39 54.46,8.11 51.51,8.11 51.51,7.39 49.15,7.39 49.07,7.32 47.47,7.32 45.49,9.3 v43.74,9.3 40.62,9.3 38.79,11.13 38.79,11.51 36.35,13.95 v32.31,13.95
TXD  (via drill 0.33)
  Top 0.152: v15.32,13.95 13.79,12.42 12.12,12.42 IC3.3 | v39.62,14.18 39.62,13.49 40.08,13.03 IC1.31 | v44.88,19.51 44.88,18.75 43.97,17.83 41.91,17.83 40.77,16.69 v40.62,16.69
  Bottom 0.152: v15.32,13.95 20.19,13.95 23.16,16.92 23.16,18.52 26.36,21.72 36.27,21.72 38.02,19.97 38.94,19.97 39.62,19.28 39.62,16.69 40.12,16.2 | 40.12,16.2 41,15.32 41,14.86 40.31,14.18 v39.62,14.18 | v44.88,19.51 45.7,20.49 57.91,20.51 57.94,20.51 58.53,20.17 64.21,20.16 65.23,19.21 68.2,19.21 JP5.12 | 40.12,16.2 v40.62,16.69
VBAT  (via drill 0.33)
  Top 0.152: 7.77,20.51 7.7,19.05 7.71,18.98 | 7.77,20.51 8.06,20.59 8.14,20.59 9.22,20.58 | v19.81,15.7 19.81,14.63 BATTPOWER.2 | v21.72,18.44 22.55,18.44 23.16,19.05 J1.2 | v7.79,20.5 7.77,20.51 | 7.71,18.98 7.7,17.63 D4.C | v9.97,17.96 10.35,18.1 10.63,18.19 10.88,18.19 IC2.3 | v8.67,18.98 7.71,18.98
  Bottom 0.152: v19.81,15.7 21.72,17.61 v21.72,18.44 | v21.72,18.44 25.91,22.63 43.89,22.63 44.73,21.8 68.2,21.8 JP5.14 | v7.79,20.5 7.89,20.6 10.44,20.6 18.06,20.2 18.29,20.42 19.28,20.42 21.18,18.52 21.72,18.52 v21.72,18.44 | CN1.1 13.25,17.55 10.95,17.71 10.77,17.74 v9.97,17.96 9.09,18.84 v8.67,18.98
VBUS  (via drill 0.33)
  Top 0.152: v8.59,19.87 8.7,19.85 8.65,19.85 9.8,19.92 C4.1 9.75,19.66 10.52,19.66 | C1.2 9.53,12.96 9.5,12.86 v9.18,11.75 9.44,11.75 D3.C | 10.52,19.66 11.28,19.66 R1.2 | 10.52,19.66 10.52,18.85 IC2.4 | v5.63,20.64 6.4,21.64 IC6.2 | v35.51,15.7 36.12,15.7 37.72,17.3 40.92,17.3 42.52,18.9 43.59,18.9 ISP.2 | v24.69,17.83 21.49,17.83 20.8,18.52 v18.67,18.52
  Bottom 0.152: v9.18,11.75 9.22,13.19 10.13,14.1 10.15,15.13 | 10.15,15.13 10.13,16.23 6.2,16.26 5.02,17.44 5.02,17.78 v8.59,19.87 7.92,19.59 v5.63,20.64 | v35.51,15.7 34.06,15.7 31.93,17.83 v24.69,17.83 | v18.67,18.52 18.14,18.52 15.4,15.13 10.15,15.13
VCC  (via drill 0.33)
  Top 0.152: 19.58,7.17 19.58,7.85 R9.2 | 19.58,7.17 19.58,6.25 R10.2 | 26.94,16.2 24.46,13.72 23.85,13.72 RTC-DS3231.2 23.77,13.64 23.24,13.64 22.4,12.8 22.4,7.62 21.95,7.17 19.58,7.17 | 26.94,16.2 26.98,16.23 26.98,16.77 R3.2 27.05,16.77 27.89,17.61 27.89,19.82 27.74,19.97 23.39,19.97 22.4,20.96 22.4,22.25 22.55,22.41 23.85,22.41 24.38,21.87 25.07,21.87 IC4.3 | REMOTE.2 51.59,18.37 49.38,18.37 48.01,19.74 SDPWER.2 48.08,19.59 44.73,16.23 44.73,15.17 45.87,14.02 45.87,13.64 46.86,12.65 48.69,12.65 49,12.96 IC1.18 49.07,13.03 49.76,13.72 v50.06,13.72 | v51.66,11.66 51.66,10.52 C11.2 | 42.14,8.99 42.22,8.99 42.75,8.46 42.75,7.85 42.44,7.55 IC1.6 42.37,7.47 41.99,7.47 41.68,7.17 40.86,7.3 40.4,7.51 39.34,8.37 38.75,7.97 v38.2,7.52 | 42.14,8.99 41.99,8.99 41.68,8.69 41.3,8.69 IC1.4 | v34.67,16.69 33.6,16.69 C6.1 | v32.31,18.29 30.56,18.29 IC5.8 | 30.48,18.29 IC5.8 | v46.02,11.36 45.11,11.36 44.96,11.51 v43.97,11.51 | 42.14,8.99 v42.14,11.51 | 26.94,16.2 26.98,16.16 27.81,16.16 28.04,15.93 29.26,15.93 29.57,16.23 29.57,17.3 30.48,18.21 IC5.8
  Bottom 0.152: v50.06,13.72 51.66,12.12 v51.66,11.66 51.28,11.66 50.9,11.28 50.37,11.28 49.38,12.27 46.94,12.27 v46.02,11.36 | v34.67,16.69 33.91,16.69 v32.31,18.29 32.16,18.44 24.46,18.44 24.08,18.06 24.08,15.09 32,7.17 v38.2,7.52 | v43.97,11.51 43.13,11.51 43.05,11.43 42.22,11.43 v42.14,11.51
VDD
  Top 0.152: C5.1 28.57,16.77 28.57,19.82 26.59,21.8 IC4.2 26.52,21.8 25.68,20.96 24.69,20.96 24.08,21.57 23.24,21.57 J1.1

### Text on the board
tPlace: CHG | + | ON | eeprom | RST | SCK | MISO | - | IC2 | GND | MOSI | VBUS | OFF | battpwr | 328p | CH340G | X2 | ACT
bPlace: + | RIFFLE-328p ver 0.95 | VBAT | TX | A0 | SCL | RX | SDA | SCK | D2 | - | MISO | MOSI | D3 | 3V3 | D10 | GND | A1 | A2 | D4 | D5 | publiclab.org/wiki/riffle